# Altium schematic sheet [03] - Controller.SchDoc
size A3
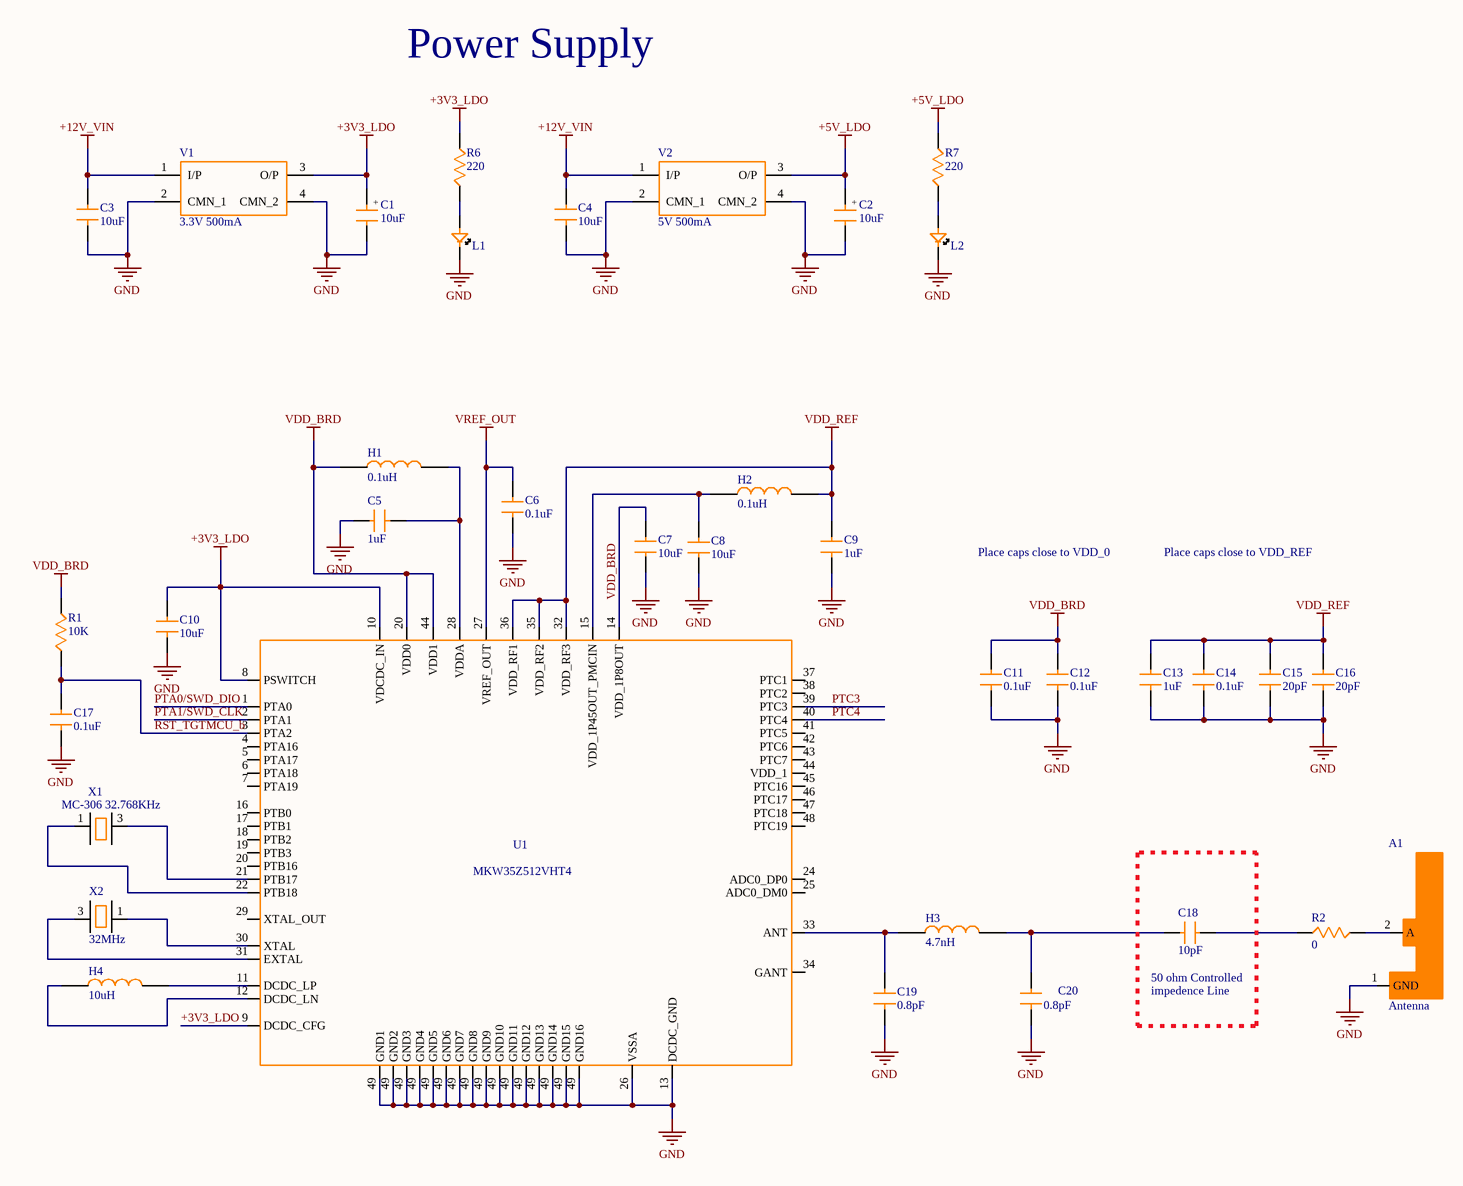
[diagram p0: [03] - Controller.SchDoc]

## Parts
A1  Antenna  [Antenna]
C1  10uF  [C1206]
C2  10uF  [C1206]
C3  10uF  [C1206]
C4  10uF  [C1206]
C5  1uF  [C0805]
C6  0.1uF  [C0805]
C7  10uF  [C0805]
C8  10uF  [C0805]
C9  1uF  [C0805]
C10  10uF  [C1206]
C11  0.1uF  [C0805]
C12  0.1uF  [C0805]
C13  1uF  [C0805]
C14  0.1uF  [C0805]
C15  20pF  [C0805]
C16  20pF  [C0805]
C17  0.1uF  [C0805]
C18  10pF  [C0805]
C19  0.8pF  [C0805]
C20  0.8pF  [C0805]
H1  0.1uH  [I-0805]
H2  0.1uH  [I-0805]
H3  4.7nH  [I-0805]
H4  10uH  [SRN4018]
L1  599-0130-007F  [LED0805]  (value not drawn)
L2  599-0130-007F  [LED0805]  (value not drawn)
R1  10K  [R0805]
R2  0  [R0805]
R6  220  [R0805]
R7  220  [R0805]
U1  MKW35Z512VHT4  [MKW35Z512VHT4]
V1  3.3V 500mA  [UA78M05/33-CDCYR]
V2  5V 500mA  [UA78M05/33-CDCYR]
X1  MC-306 32.768KHz  [MC-306_32.768KHz]
X2  32MHz  [ECS-250-18-30B-JTN-TR]

## Nets
+3V3_LDO: C1.1 C10.2 R6.2 U1.8(PSWITCH) U1.9(DCDC_CFG) U1.10(VDCDC_IN) V1.3(O/P)
+5V_LDO: C2.1 R7.2 V2.3(O/P)
+12V_VIN: C3.2 C4.2 V1.1(I/P) V2.1(I/P)
GND: A1.1(GND) C1.2 C2.2 C3.1 C4.1 C5.2 C6.1 C7.1 C8.1 C9.1 C10.1 C11.1 C12.1 C13.1 C14.1 C15.1 C16.1 C17.1 C19.1 C20.1 L1.2 L2.2 U1.13(DCDC_GND) U1.26(VSSA) U1.49(GND1) V1.2(CMN_1) V1.4(CMN_2) V2.2(CMN_1) V2.4(CMN_2)
VDD_BRD: C7.2 C11.2 C12.2 H1.1 R1.2 U1.14(VDD_1P8OUT) U1.20(PTB16) U1.44(VDD_1)
VDD_REF: C9.2 C13.2 C14.2 C15.2 C16.2 H2.2 U1.32(VDD_RF3) U1.35(VDD_RF2) U1.36(VDD_RF1)
VREF_OUT: C6.2 U1.27(VREF_OUT)
PTA0/SWD_DIO: U1.1(PTA0)
PTA1/SWD_CLK: U1.2(PTA1)
PTC3: U1.39(PTC3)
PTC4: U1.40(PTC4)
RST_TGTMCU_b: C17.2 R1.1 U1.3(PTA2)
NetA1_2: A1.2(A) R2.2
NetC5_1: C5.1 H1.2 U1.28(VDDA)
NetC8_2: C8.2 H2.1 U1.15(VDD_1P45OUT_PMCIN)
NetC18_1: C18.1 R2.1
NetC18_2: C18.2 C20.2 H3.2
NetC19_2: C19.2 H3.1 U1.33(ANT)
NetH4_1: H4.1 U1.12(DCDC_LN)
NetH4_2: H4.2 U1.11(DCDC_LP)
NetL1_1: L1.1 R6.1
NetL2_1: L2.1 R7.1
NetU1_21: U1.21(PTB17) X1.3
NetU1_22: U1.22(PTB18) X1.1
NetU1_30: U1.30(XTAL) X2.1
NetU1_31: U1.31(EXTAL) X2.3

Not connected (* = marked no-connect by the designer): U1 4(PTA16) 5(PTA17) 6(PTA18) 7(PTA19) 16(PTB0) 17(PTB1) 18(PTB2) 19(PTB3) 24(ADC0_DP0) 25(ADC0_DM0) 29(XTAL_OUT) 34(GANT) 37(PTC1) 38(PTC2) 41(PTC5) 42(PTC6) 43(PTC7) 45(PTC16) 46(PTC17) 47(PTC18) 48(PTC19)

## Notes on the sheet
- Power Supply
- Place caps close to VDD_0
- Place caps close to VDD_REF
- (near C18) 50 ohm Controlled
- (near C18) impedence Line
- (in symbol EIA_A-4.7uF,10V) +

## Library data of the parts
C1 C2 = EIA_A-4.7uF,10V: Tantalum Capacitors - Polymer SMD 10V 4.7uF 20% 1206 ESR=300mOhm; Manufacturer: AVX; Manufacturer Part Number: TCJK475M010R0300; Mfr Case Code: K Case; Type: Tantalum Solid Electrolytic Chip Capacitors with Conductive Polymer Electrode; Voltage Rating DC: 10 VDC; ESR: 300 mOhms; Leakage Current: 4.7 uA; Dissipation Factor DF: 6 %; Ripple Current: 400 mA; Supplier 1: Mouser; RoHS: RoHS Compliant; Category: Tantalum Capacitors - Polymer SMD; Stock 1: 1411; Pricing 1: 1=1.08, 10=0.911, 100=0.485, 500=0.437, 1000=0.398, 3000=0.267, 24000=0.257, 45000=0.247 (USD); Capacitance: 4.7 uF; Height: 1 mm; Length: 3.2 mm; Package / Case: 1206 (3216 metric); Packaging: Cut Tape; Product: Tantalum Organic Polymer Standard Grade; Series: TCJ; Termination Style: SMD/SMT; Tolerance: 20 %; Width: 1.6 mm; Brand: AVX; Case Code - in: 1206; Case Code - mm: 3216; Maximum Operating Temperature: + 105 C; Minimum Operating Temperature: - 55 C; Product Type: Tantalum Capacitors; Standard Pack Qty: 3000; Subcategory: Capacitors; RoHS - Mouser: Y; Minimum Order Quantity: 1; Reeling: True; ComponentLink1URL: https://www.mouser.com/datasheet/2/40/tcj-776064.pdf; ComponentLink1Description: https://www.mouser.com/datasheet/2/40/tcj-776064.pdf; Supplier Part Number 1: 581-TCJK475M010R0300
C3 C4 C10 = C_1206-10uF: Multilayer Ceramic Capacitors MLCC - SMD/SMT 10uF Y5V -20/+80% 50V; Manufacturer: Yageo; Manufacturer Part Number: CC1210ZKY5V9BB106; Tolerance: - 20 %, + 80 %; Type: MLCC Surface Mount Ceramic Capacitor; Voltage Rating DC: 50 VDC; Class: Class 2; Supplier 1: Mouser; RoHS: RoHS Compliant; Category: Multilayer Ceramic Capacitors MLCC - SMD/SMT; Stock 1: 4065; Pricing 1: 1=0.760, 10=0.524, 100=0.298, 500=0.287, 1000=0.279, 2000=0.270 (USD); Capacitance: 10 uF; Height: 1.5 mm; Length: 3.2 mm; Package / Case: 1210 (3225 metric); Packaging: Cut Tape; Product: General Type MLCCs; Series: CC; Termination Style: SMD/SMT; Width: 2.5 mm; Brand: Yageo; Case Code - in: 1210; Case Code - mm: 3225; Dielectric: Y5V; Maximum Operating Temperature: + 85 C; Minimum Operating Temperature: - 30 C; Product Type: Ceramic Capacitors; Standard Pack Qty: 2000; Subcategory: Capacitors; Termination: Standard; RoHS - Mouser: Y; Minimum Order Quantity: 1; Reeling: True; ComponentLink1URL: https://www.mouser.com/datasheet/2/447/UPY-GPHC_Y5V_6.3V-to-50V_8-1280790.pdf; ComponentLink1Description: https://www.mouser.com/datasheet/2/447/UPY-GPHC_Y5V_6.3V-to-50V_8-1280790.pdf; Supplier Part Number 1: 603-CC121ZKY5V9BB106
C5 C9 C13 = C_0805-1uF: Multilayer Ceramic Capacitors MLCC - SMD/SMT 10V 1uF X7R 0805 10%; Manufacturer: KEMET; Manufacturer Part Number: C0805C105K8RAC7210; Voltage Rating DC: 10 VDC; Capacitance - nF: 1000 nF; Class: Class 2; Product Status: New Product; Supplier 1: Mouser; RoHS: RoHS Compliant; Category: Multilayer Ceramic Capacitors MLCC - SMD/SMT; Stock 1: 38596; Pricing 1: 1=0.230, 10=0.104, 100=0.064, 500=0.057, 1000=0.048, 2000=0.041, 10000=0.036, 15000=0.032, 45000=0.028 (USD); Capacitance: 1 uF; Height: 0.9 mm; Length: 2 mm; Package / Case: 0805 (2012 metric); Packaging: Cut Tape; Product: General Type MLCCs; Series: SMD Comm X7R; Termination Style: SMD/SMT; Tolerance: 10 %; Width: 1.25 mm; Brand: KEMET; Case Code - in: 0805; Case Code - mm: 2012; Dielectric: X7R; Maximum Operating Temperature: + 125 C; Minimum Operating Temperature: - 55 C; Product Type: Ceramic Capacitors; Standard Pack Qty: 15000; Subcategory: Capacitors; Termination: Standard; RoHS - Mouser: Y; Minimum Order Quantity: 1; Reeling: True; ComponentLink1URL: https://www.mouser.com/datasheet/2/212/KEM_C1002_X7R_SMD-1102033.pdf; ComponentLink1Description: https://www.mouser.com/datasheet/2/212/KEM_C1002_X7R_SMD-1102033.pdf; Supplier Part Number 1: 80-C0805C105K8R7210
C6 C11 C12 C14 C17 = C_0805-0.1uF: Multilayer Ceramic Capacitors MLCC - SMD/SMT 0.1uF 10% 50V AEC-Q200; Manufacturer: Yageo; Manufacturer Part Number: AS0805KKX7R9BB104; Voltage Rating DC: 50 VDC; Capacitance - nF: 100 nF; Capacitance - pF: 100000 pF; CNHTS: 8532241000; Dielectric: X7R; TARIC: 8532240000; Product Status: New Product; Supplier 1: Mouser; RoHS: RoHS Compliant; Category: Multilayer Ceramic Capacitors MLCC - SMD/SMT; Stock 1: 30283; Pricing 1: 1=0.670, 10=0.461, 100=0.262, 500=0.238, 1000=0.165, 3000=0.156, 6000=0.146, 9000=0.136, 24000=0.122 (USD); Capacitance: 0.1 uF; Height: 1.25 mm; Length: 2 mm; Package / Case: 0805 (2012 metric); Packaging: Cut Tape; Product: Automotive MLCCs; Series: AS; Termination Style: SMD/SMT; Tolerance: 10 %; Width: 1.25 mm; Brand: Yageo; Case Code - in: 0805; Case Code - mm: 2212; HTS Code: 8532240020; Maximum Operating Temperature: + 125 C; Minimum Operating Temperature: - 55 C; Product Type: Ceramic Capacitors; Standard Pack Qty: 3000; Subcategory: Capacitors; Termination: Flexible (Soft); RoHS - Mouser: Y; Minimum Order Quantity: 1; Reeling: True; ComponentLink1URL: http://www.mouser.com/datasheet/2/447/yageodocoutput-1313910.pdf; ComponentLink1Description: http://www.mouser.com/datasheet/2/447/yageodocoutput-1313910.pdf; Supplier Part Number 1: 603-AS0805KKX79BB104
C7 C8 C18 = C_0805-10uF: Multilayer Ceramic Capacitors MLCC - SMD/SMT 10uF 10% 25V; Manufacturer: Yageo; Manufacturer Part Number: CC0805KFX5R8BB106; Type: MLCC Surface Mount Ceramic Capacitor; Voltage Rating DC: 25 VDC; Class: Class 2; CNHTS: 8532241000; Dielectric: X5R; TARIC: 8532240000; Product Status: New Product; Supplier 1: Mouser; RoHS: RoHS Compliant; Category: Multilayer Ceramic Capacitors MLCC - SMD/SMT; Stock 1: 9112; Pricing 1: 1=0.550, 10=0.342, 100=0.175, 1000=0.158, 2500=0.110, 10000=0.106, 20000=0.103, 50000=0.096, 100000=0.089 (USD); Capacitance: 10 uF; Height: 1.25 mm; Length: 2 mm; Package / Case: 0805 (2012 metric); Packaging: Cut Tape; Product: General Type MLCCs; Series: CC; Termination Style: SMD/SMT; Tolerance: 10 %; Width: 1.25 mm; Brand: Yageo; Case Code - in: 0805; Case Code - mm: 2012; HTS Code: 8532240020; Maximum Operating Temperature: + 85 C; Minimum Operating Temperature: - 55 C; Product Type: Ceramic Capacitors; Standard Pack Qty: 10000; Subcategory: Capacitors; Termination: Standard; RoHS - Mouser: Y; Minimum Order Quantity: 1; Reeling: True; ComponentLink1URL: http://www.mouser.com/datasheet/2/447/UPY-GPHC_X5R_4V-to-50V_25-1131599.pdf; ComponentLink1Description: http://www.mouser.com/datasheet/2/447/UPY-GPHC_X5R_4V-to-50V_25-1131599.pdf; Supplier Part Number 1: 603-CC0805KFX5R8BB10
C15 C16 C19 C20 = C_0805-20pF: Multilayer Ceramic Capacitors MLCC - SMD/SMT 20pF 100volts C0G 5%; Manufacturer: Vishay / Vitramon; Manufacturer Part Number: VJ0805A200JXBAC; Type: Commercial SMD MLCCs; Voltage Rating DC: 100 VDC; Class: Class 1; CNHTS: 8532241000; Compliance: Take; Dielectric: C0G (NP0); TARIC: 8532240000; Supplier 1: Mouser; RoHS: In Transition; Category: Multilayer Ceramic Capacitors MLCC - SMD/SMT; Stock 1: 4908; Pricing 1: 1=0.330, 50=0.250, 100=0.200, 500=0.160, 1000=0.130, 3000=0.090, 6000=0.077, 9000=0.075, 12000=0.072 (USD); Capacitance: 20 pF; Height: 1.45 mm; Length: 2 mm; Package / Case: 0805 (2012 metric); Packaging: Cut Tape; Product: General Type MLCCs; Series: VJ COMM; Termination Style: SMD/SMT; Tolerance: 5 %; Width: 1.25 mm; Brand: Vishay / Vitramon; Case Code - in: 0805; Case Code - mm: 2012; HTS Code: 8532240020; Maximum Operating Temperature: + 150 C; Minimum Operating Temperature: - 55 C; Product Type: Ceramic Capacitors; Standard Pack Qty: 3000; Subcategory: Capacitors; Termination: Standard; RoHS - Mouser: T; Minimum Order Quantity: 1; Reeling: True; ComponentLink1URL: https://www.mouser.com/datasheet/2/427/vjcommercialseries-222796.pdf; ComponentLink1Description: https://www.mouser.com/datasheet/2/427/vjcommercialseries-222796.pdf; Supplier Part Number 1: 77-VJ0805A200JXBAC
H1 H2 = I_0805-0.1uH: Fixed Inductors .1uH 5%; Manufacturer: Vishay / Dale; Manufacturer Part Number: IMC0805ERR10J01; Core Material: Ceramic; Inductance: 100 nH; Maximum DC Current: 285 mA; Maximum DC Resistance: 140 mOhms; Q Minimum: 60; Self Resonant Frequency: 1200 MHz; Shielding: Unshielded; Test Frequency: 500 MHz; Supplier 1: Mouser; RoHS: RoHS Compliant; Category: Fixed Inductors; Stock 1: 4636; Pricing 1: 1=0.130, 50=0.127, 100=0.118, 500=0.113, 2000=0.112, 4000=0.101, 8000=0.093, 12000=0.090 (USD); Height: 1.2 mm; Length: 2 mm; Package / Case: 0805 (2012 metric); Packaging: Cut Tape; Product: Fixed Inductors; Series: IMC-0805-01; Termination Style: SMD/SMT; Tolerance: 5 %; Type: Wirewound; Width: 1.25 mm; Brand: Vishay / Dale; Case Code - in: 0805; Case Code - mm: 2012; Maximum Operating Temperature: + 125 C; Minimum Operating Temperature: - 40 C; Product Type: Fixed Inductors; Standard Pack Qty: 2000; Subcategory: Inductors, Chokes & Coils; Termination: -; RoHS - Mouser: Y; Minimum Order Quantity: 1; Reeling: True; ComponentLink1URL: https://www.mouser.com/datasheet/2/427/imc08051-239795.pdf; ComponentLink1Description: https://www.mouser.com/datasheet/2/427/imc08051-239795.pdf; Supplier Part Number 1: 70-IMC0805ERR10J01
H3 = I_0805-4.7nH: Fixed Inductors 4.7nH; Manufacturer: AVX; Manufacturer Part Number: L08054R7DEWTR; Maximum DC Current: 1.5 A; Maximum DC Resistance: 100 mOhms; Q Minimum: 43; Self Resonant Frequency: 5.5 GHz; Shielding: Unshielded; Tolerance: 0.5 nH; Test Frequency: 450 MHz; Supplier 1: Mouser; RoHS: No; Category: Fixed Inductors; Stock 1: 3506; Pricing 1: 1=1.34, 10=1.12, 100=0.600, 500=0.540, 1000=0.492, 3000=0.330, 24000=0.318 (USD); Application: High Frequency; Height: 0.91 mm; Inductance: 4.7 nH; Length: 2.11 mm; Package / Case: 0805 (2012 metric); Packaging: Cut Tape; Product: Fixed Inductors; Series: 0603, 0805; Termination Style: SMD/SMT; Width: 1.5 mm; Brand: AVX; Mounting Style: PCB Mount; Case Code - in: 0805; Case Code - mm: 2012; Maximum Operating Temperature: + 125 C; Minimum Operating Temperature: - 55 C; Product Type: Fixed Inductors; Standard Pack Qty: 3000; Subcategory: Inductors, Chokes & Coils; Termination: Standard; Tradename: Accu-L; RoHS - Mouser: N; Minimum Order Quantity: 1; Reeling: True; ComponentLink1URL: https://www.mouser.com/datasheet/2/40/acculsmd-776478.pdf; ComponentLink1Description: https://www.mouser.com/datasheet/2/40/acculsmd-776478.pdf; Supplier Part Number 1: 581-L08054R7DEWTR
H4 = SRN4018-100M: Fixed Inductors 10uH 20% SMD 4018; Manufacturer: Bourns; Core Material: Ferrite; Maximum DC Current: 1.3 A; Maximum DC Resistance: 180 mOhms; Shielding: Shielded; CNHTS: 8504500000; MXHTS: 85045002; TARIC: 8504509590; Test Frequency: 100 kHz; Supplier 1: Mouser; Manufacturer Part Number: SRN4018-100M; RoHS: RoHS Compliant; Category: Fixed Inductors; Stock 1: 11328; Pricing 1: 1=0.360, 10=0.246, 100=0.224, 250=0.210, 500=0.188, 1000=0.152, 3000=0.133, 6000=0.132, 9000=0.122 (USD); Application: Power; Height: 1.8 mm; Inductance: 10 uH; Length: 4 mm; Packaging: Cut Tape; Product: Fixed Inductors; Series: SRN4018; Termination Style: SMD/SMT; Tolerance: 20 %; Width: 4 mm; Brand: Bourns; Mounting Style: PCB Mount; HTS Code: 8504508000; Maximum Operating Temperature: + 120 C; Minimum Operating Temperature: - 25 C; Product Type: Fixed Inductors; Standard Pack Qty: 3000; Subcategory: Inductors, Chokes & Coils; Termination: -; RoHS - Mouser: Y; Minimum Order Quantity: 1; Reeling: True; ComponentLink1URL: http://www.mouser.com/datasheet/2/54/rn4018-1391320.pdf; ComponentLink1Description: http://www.mouser.com/datasheet/2/54/rn4018-1391320.pdf; Supplier Part Number 1: 652-SRN4018-100M
L1 L2 = 599-0130-007F: Standard LEDs - SMD SMD 0805 ORANGE; Manufacturer: Dialight; Lens Color/Style: Clear; Luminous Intensity: 95 mcd; Viewing Angle: 140 deg; CNHTS: 8541401000; If - Forward Current: 20 mA; Vf - Forward Voltage: 2.1 V; Wavelength/Color Temperature: 605 nm; Product Status: New Product; Supplier 1: Mouser; Manufacturer Part Number: 599-0130-007F; RoHS: RoHS Compliant; Category: Standard LEDs - SMD; Stock 1: 15445; Pricing 1: 1=0.450, 10=0.264, 100=0.106, 1000=0.083, 2500=0.060, 4000=0.060, 8000=0.053, 24000=0.050 (USD); Height: 0.7 mm; Illumination Color: Orange; Length: 2 mm; Orientation: Top View; Package / Case: 0805 (2012 metric); Packaging: Cut Tape; Product: Orange LEDs; Width: 1.25 mm; Brand: Dialight; Mounting Style: SMD/SMT; HTS Code: 8541402000; Maximum Operating Temperature: + 100 C; Minimum Operating Temperature: - 40 C; Product Type: LED - Standard; Standard Pack Qty: 4000; Subcategory: LEDs; RoHS - Mouser: Y; Minimum Order Quantity: 1; Reeling: True; ComponentLink1URL: http://www.mouser.com/datasheet/2/109/Dialight_CBI_data_599-0805_Apr2018-1370606.pdf; ComponentLink1Description: http://www.mouser.com/datasheet/2/109/Dialight_CBI_data_599-0805_Apr2018-1370606.pdf; Supplier Part Number 1: 645-599-0130-007F
R1 = R_0805-10K: Thick Film Resistors - SMD 10K   OHM   1% 1/4W; Manufacturer: Yageo; Manufacturer Part Number: RC0805FR-7W10KL; Power Rating: 125 mW, 250 mW; Resistance: 10 kOhms; Temperature Coefficient: 100 PPM / C; Voltage Rating: 150 V; CNHTS: 8533211000; MXHTS: 85332101; TARIC: 8533210000; Supplier 1: Mouser; RoHS: RoHS Compliant; Category: Thick Film Resistors - SMD; Stock 1: 8240; Pricing 1: 1=0.190, 10=0.115, 100=0.038, 1000=0.026, 5000=0.020, 10000=0.019, 25000=0.018, 100000=0.017 (USD); Application: High Reliability; Features: -; Height: 0.5 mm; Length: 2 mm; Package / Case: 0805 (2012 metric); Packaging: Cut Tape; Product: Thick Film Resistors SMD; Series: RC; Technology: Thick Film; Termination Style: SMD/SMT; Tolerance: 1 %; Type: High Power; Width: 1.25 mm; Brand: Yageo; Mounting Style: PCB Mount; Case Code - in: 0805; Case Code - mm: 2012; HTS Code: 8533210030; Maximum Operating Temperature: + 155 C; Minimum Operating Temperature: - 55 C; Product Type: Thick Film Resistors; Standard Pack Qty: 5000; Subcategory: Resistors; RoHS - Mouser: Y; Minimum Order Quantity: 1; Reeling: True; ComponentLink1URL: http://www.mouser.com/datasheet/2/447/yageo_01152019_DESIGN_KITS_8_2012-1522572.pdf; ComponentLink1Description: http://www.mouser.com/datasheet/2/447/yageo_01152019_DESIGN_KITS_8_2012-1522572.pdf; Supplier Part Number 1: 603-RC0805FR-7W10KL
R2 = R_0805-0: Current Sense Resistors - SMD 0 ohm Jumper 1/2W; Manufacturer: Yageo; Manufacturer Part Number: PA0805-R-470RL; Power Rating: 500 mW (1/2 W); Resistance: 0 Ohms; CNHTS: 8533211000; TARIC: 8533210000; Product Status: New Product; Supplier 1: Mouser; RoHS: RoHS Compliant; Category: Current Sense Resistors - SMD; Stock 1: 3927; Pricing 1: 1=1.30, 10=1.06, 100=0.706, 500=0.595, 1000=0.495, 5000=0.431, 10000=0.421, 25000=0.409 (USD); Application: Current Sense; Length: 2.03 mm; Packaging: Cut Tape; Product: Current Sense Chip Resistor Surface Mount; Series: PA_L; Technology: Metal Element; Termination Style: SMD/SMT; Tolerance: -; Type: Low TCR Current Sense Resistor; Width: 1.27 mm; Brand: Yageo; Mounting Style: PCB Mount; Case Code - in: 0805; Case Code - mm: 2012; HTS Code: 8533210030; Maximum Operating Temperature: + 155 C; Minimum Operating Temperature: - 55 C; Product Type: Current Sense Resistors; Standard Pack Qty: 5000; Subcategory: Resistors; Termination: 2 Terminal; RoHS - Mouser: Y; Minimum Order Quantity: 1; Reeling: True; ComponentLink1URL: http://www.mouser.com/datasheet/2/447/PYu-PA0805_L_51_RoHS_0-1480254.pdf; ComponentLink1Description: http://www.mouser.com/datasheet/2/447/PYu-PA0805_L_51_RoHS_0-1480254.pdf; Supplier Part Number 1: 603-PA0805-R-470RL
R6 R7 = R_0805-220: Thin Film Resistors - SMD; Manufacturer: Yageo; Manufacturer Part Number: RT0805DRE07220RL; Power Rating: 125 mW (1/8 W); Resistance: 220 Ohms; Temperature Coefficient: 50 PPM / C; Tolerance: 0.5 %; Voltage Rating: 150 V; CNHTS: 8533211000; MXHTS: 85332101; TARIC: 8533210000; Supplier 1: Mouser; RoHS: RoHS Compliant; Category: Thin Film Resistors - SMD; Stock 1: 14351; Pricing 1: 1=0.170, 10=0.088, 100=0.031, 1000=0.022, 5000=0.015, 10000=0.014, 25000=0.013, 50000=0.012 (USD); Features: -; Height: 0.5 mm; Length: 2 mm; Operating Temperature Range: - 55 C to + 125 C; Packaging: Cut Tape; Product: Thin Film Resistors SMD; Series: RT; Technology: Thin Film; Termination Style: SMD/SMT; Type: High Precision, High Stability; Width: 1.2 mm; Brand: Yageo; Mounting Style: PCB Mount; Case Code - in: 0805; Case Code - mm: 2012; HTS Code: 8533210030; Maximum Operating Temperature: + 125 C; Minimum Operating Temperature: - 55 C; Product Type: Thin Film Resistors; Standard Pack Qty: 5000; Subcategory: Resistors; RoHS - Mouser: Y; Minimum Order Quantity: 1; Reeling: True; ComponentLink1URL: https://www.mouser.com/datasheet/2/447/PYu-RT_1-to-0.01_RoHS_L_9-1222720.pdf; ComponentLink1Description: https://www.mouser.com/datasheet/2/447/PYu-RT_1-to-0.01_RoHS_L_9-1222720.pdf; Supplier Part Number 1: 603-RT0805DRE07220RL
U1 = MKW35Z512VHT4: RF System on a Chip - SoC Kinetis W 32-bit MCU, ARM Cortex-M0+, 512KB Flash, 64KB SRAM, 48MHz, BLE, 48LQFN; Manufacturer: NXP Semiconductors; Operating Frequency: 2.4 GHz; Output Power: 3.5 dBm; Sensitivity: - 95 dBm; Interface Type: Serial; ADC Resolution: 16 bit; Core: ARM Cortex M0+; Operating Supply Voltage: 2.1 V to 3.6 V; Supply Current Receiving: 6.3 mA; Supply Current Transmitting: 5.7 mA; Product Status: New Product; Supplier 1: Mouser; Manufacturer Part Number: MKW35Z512VHT4; RoHS: RoHS Compliant; Category: RF System on a Chip - SoC; Stock 1: 259; Pricing 1: 1=6.12, 10=5.53, 25=4.96, 100=4.58, 250=4.50, 500=3.99, 1000=3.47, 2000=3.34 (USD); Package / Case: QFN-48; Program Memory Type: Flash; Series: KW35; Type: Bluetooth; Brand: NXP Semiconductors; Data RAM Size: 64 kB; Data RAM Type: SRAM; Mounting Style: SMD/SMT; Program Memory Size: 512 kB; Maximum Clock Frequency: 48 MHz; Maximum Operating Temperature: + 105 C; Minimum Operating Temperature: - 40 C; Product Type: RF System on a Chip - SoC; Standard Pack Qty: 260; Subcategory: Wireless & RF Integrated Circuits; Tradename: Kinetis; RoHS - Mouser: Y; Minimum Order Quantity: 1; Reeling: False; ComponentLink1URL: https://www.mouser.com/datasheet/2/302/MKW36Z512-1483673.pdf; ComponentLink1Description: https://www.mouser.com/datasheet/2/302/MKW36Z512-1483673.pdf; Supplier Part Number 1: 771-MKW35Z512VHT4
V1 = UA78M33CDCYR: Linear Voltage Regulators 3.3V 500mA Fixd Pos; Manufacturer: Texas Instruments; Input Voltage MAX: 25 V; Number of Outputs: 1 Output; Output Type: Fixed; PSRR / Ripple Rejection - Typ: 80 dB; Input Voltage MIN: 5.3 V; Line Regulation: 100 mV; Polarity: Positive; Supplier 1: Mouser; Manufacturer Part Number: UA78M33CDCYR; RoHS: RoHS Compliant; Category: Linear Voltage Regulators; Stock 1: 58727; Pricing 1: 1=0.580, 10=0.480, 100=0.310, 1000=0.248, 2500=0.225, 5000=0.210, 10000=0.202, 25000=0.194, 50000=0.187 (USD); Height: 1.6 mm; Length: 6.5 mm; Operating Temperature Range: - 40 C to + 125 C; Output Current: 500 mA; Output Voltage: 3.3 V; Package / Case: SOT-223-4; Packaging: Cut Tape; Series: UA78M33; Width: 3.5 mm; Brand: Texas Instruments; Mounting Style: SMD/SMT; Load Regulation: 100 mV; Maximum Operating Temperature: + 125 C; Minimum Operating Temperature: - 40 C; Product Type: Linear Voltage Regulators; Standard Pack Qty: 2500; Subcategory: PMIC - Power Management ICs; RoHS - Mouser: Y; Minimum Order Quantity: 1; Reeling: True; Supplier Part Number 1: 595-UA78M33CDCYR
V2 = UA78M05CDCYR: Linear Voltage Regulators 5.0V 500mA Fxd Pos; Manufacturer: Texas Instruments; Input Voltage MAX: 25 V; Number of Outputs: 1 Output; Output Type: Fixed; PSRR / Ripple Rejection - Typ: 80 dB; Input Voltage MIN: 7 V; Line Regulation: 100 mV; Polarity: Positive; Supplier 1: Mouser; Manufacturer Part Number: UA78M05CDCYR; RoHS: RoHS Compliant; Category: Linear Voltage Regulators; Stock 1: 50522; Pricing 1: 1=0.620, 10=0.510, 100=0.330, 1000=0.264, 2500=0.240, 5000=0.223, 10000=0.215, 25000=0.207, 50000=0.199 (USD); Height: 1.6 mm; Length: 6.5 mm; Operating Temperature Range: - 40 C to + 125 C; Output Current: 500 mA; Output Voltage: 5 V; Package / Case: SOT-223-4; Packaging: Cut Tape; Series: UA78M05; Width: 3.5 mm; Brand: Texas Instruments; Mounting Style: SMD/SMT; Load Regulation: 100 mV; Maximum Operating Temperature: + 125 C; Minimum Operating Temperature: - 40 C; Product Type: Linear Voltage Regulators; Standard Pack Qty: 2500; Subcategory: PMIC - Power Management ICs; RoHS - Mouser: Y; Minimum Order Quantity: 1; Reeling: True; Supplier Part Number 1: 595-UA78M05CDCYR
X1 = MC-306 32.768KHz: Crystals 32.768KHz 12.5pF 20ppm -40C +85C; Manufacturer: Epson Timing; Manufacturer Part Number: MC-306 32.7680K-A0:ROHS; ESR: 50 kOhms; CNHTS: 8541600000; Drive Level: 1 uW; MXHTS: 85416001; Supplier 1: Mouser; RoHS: RoHS Compliant By Exemption; Category: Crystals; Stock 1: 78752; Pricing 1: 1=0.430, 10=0.350, 50=0.316, 100=0.280, 500=0.246, 1000=0.224, 2000=0.210, 5000=0.203, 10000=0.196 (USD); Frequency: 32.768 kHz; Height: 2.54 mm; Length: 8 mm; Load Capacitance: 12.5 pF; Package / Case: 8 mm x 3.8 mm; Packaging: Cut Tape; Series: MC-306/MC-405/MC-406; Termination Style: SMD/SMT; Tolerance: 20 PPM; Type: Quartz Crystal; Width: 3.8 mm; Brand: Epson Timing; Mounting Style: SMD/SMT; HTS Code: 8541600010; Maximum Operating Temperature: + 85 C; Minimum Operating Temperature: - 40 C; Product Type: Crystals; Standard Pack Qty: 1000; Subcategory: Crystals; TARIC: 8541600000; RoHS - Mouser: E; Minimum Order Quantity: 1; Reeling: True; ComponentLink1URL: http://www.mouser.com/datasheet/2/137/C-306_en-1109110.pdf; ComponentLink1Description: http://www.mouser.com/datasheet/2/137/C-306_en-1109110.pdf; Supplier Part Number 1: 732-MC30632.7680KA0R
X2 = ECS-25MHz: Crystals 25MHz 20ppm 18pF -40C +85C; Manufacturer: ECS; Drive Level: 300 uW; Supplier 1: Mouser; Manufacturer Part Number: ECS-250-18-30B-JTN-TR; RoHS: RoHS Compliant; Category: Crystals; Stock 1: 1092; Pricing 1: 1=0.700, 10=0.575, 50=0.518, 100=0.460, 500=0.438, 1000=0.368, 2000=0.345, 5000=0.334, 10000=0.322 (USD); Frequency: 25 MHz; Frequency Stability: 20 PPM; Height: 0.85 mm; Length: 5 mm; Load Capacitance: 18 pF; Package / Case: 5 mm x 3.2 mm; Packaging: Cut Tape; Product: Crystals; Series: ECX-53B; Termination Style: SMD/SMT; Tolerance: 20 PPM; Width: 3.2 mm; Brand: ECS; Mounting Style: SMD/SMT; Maximum Operating Temperature: + 85 C; Minimum Operating Temperature: - 40 C; Product Type: Crystals; Standard Pack Qty: 1000; Subcategory: Crystals; RoHS - Mouser: Y; Minimum Order Quantity: 1; Reeling: True; ComponentLink1URL: https://www.mouser.com/datasheet/2/122/ecx_53b-1479911.pdf; ComponentLink1Description: https://www.mouser.com/datasheet/2/122/ecx_53b-1479911.pdf; Supplier Part Number 1: 520-250-18-30B-JTNT